# EasyEDA Pro project MicroMouse_v03_full_plane.eprj, schematic Schematic1

## Sheets
1 Overview: Board Name: Board1; Create Date: 2025-10-08; Page Name: Overview; Project Name: MicroMouse_v03; Schematic Name: Schematic1; Update Date: 2025-10-08; Company: FH-Hagenberg; Drawn: Viktor Hofer; Page Size: A3; Version: V0.1
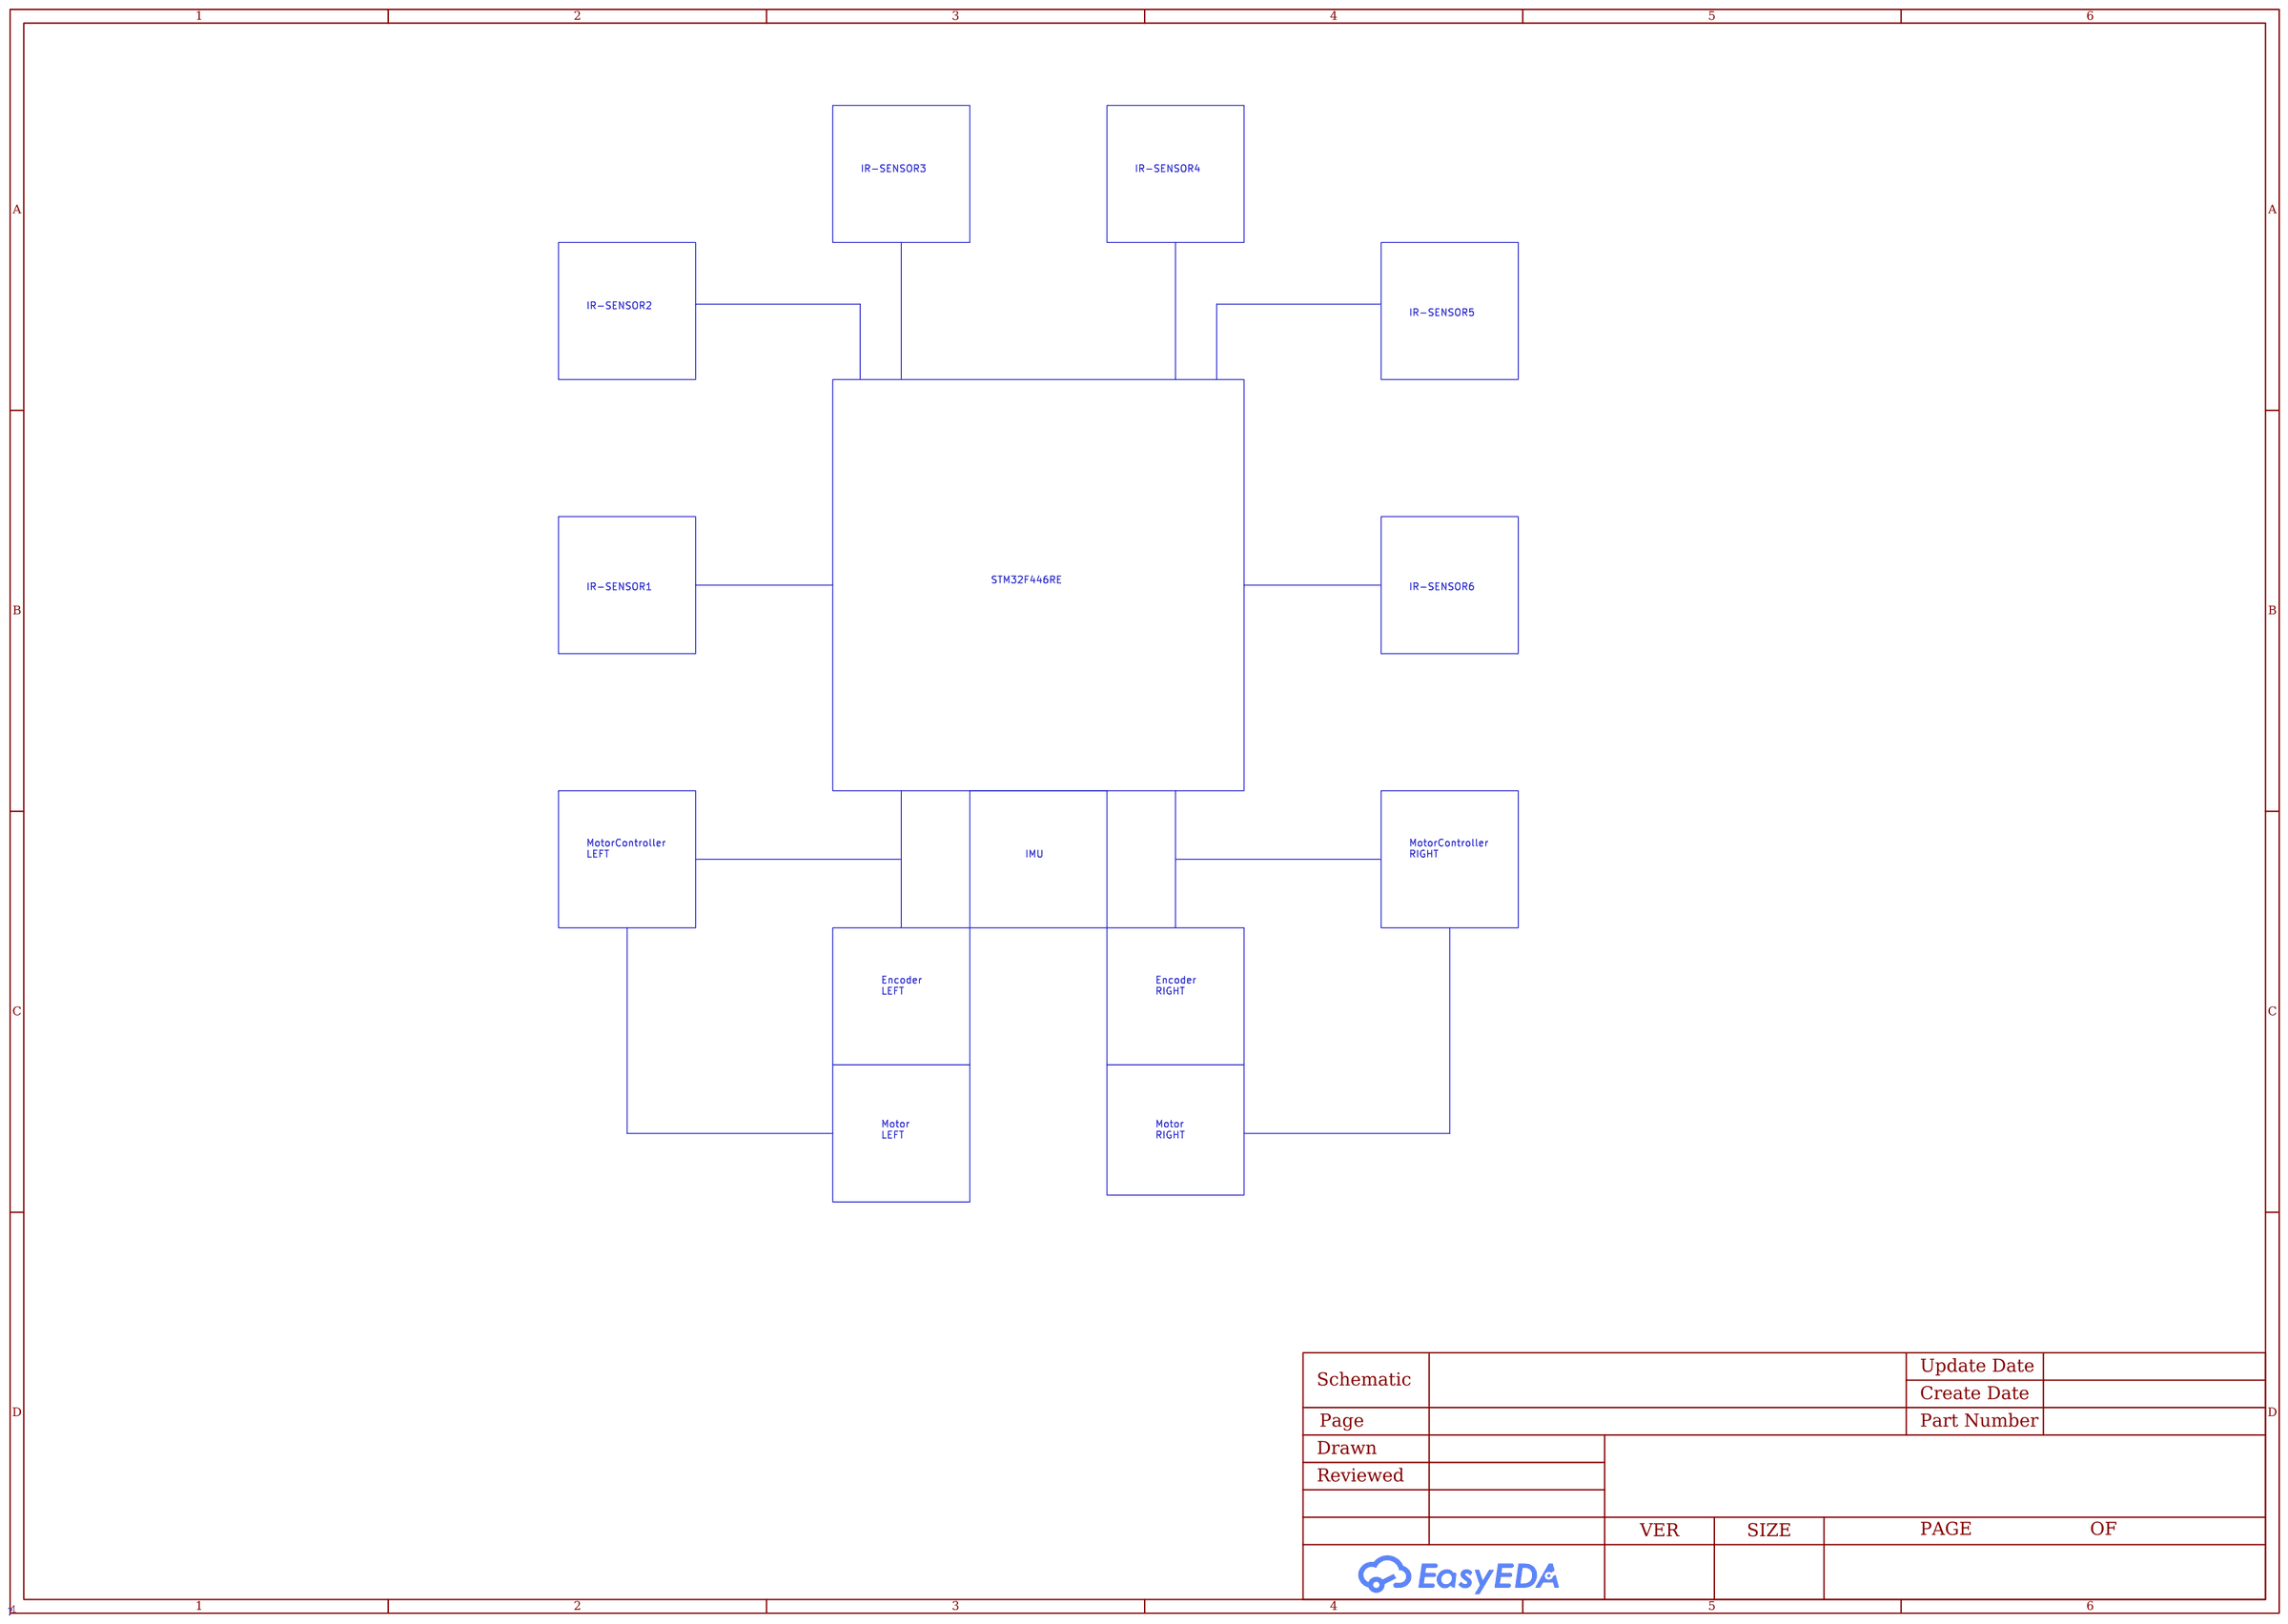
[diagram p0: Overview]
2 VCC: Create Date: 2025-12-17; Page Name: VCC; Project Name: MicroMouse_v03_full_plane; Update Date: 2025-12-17
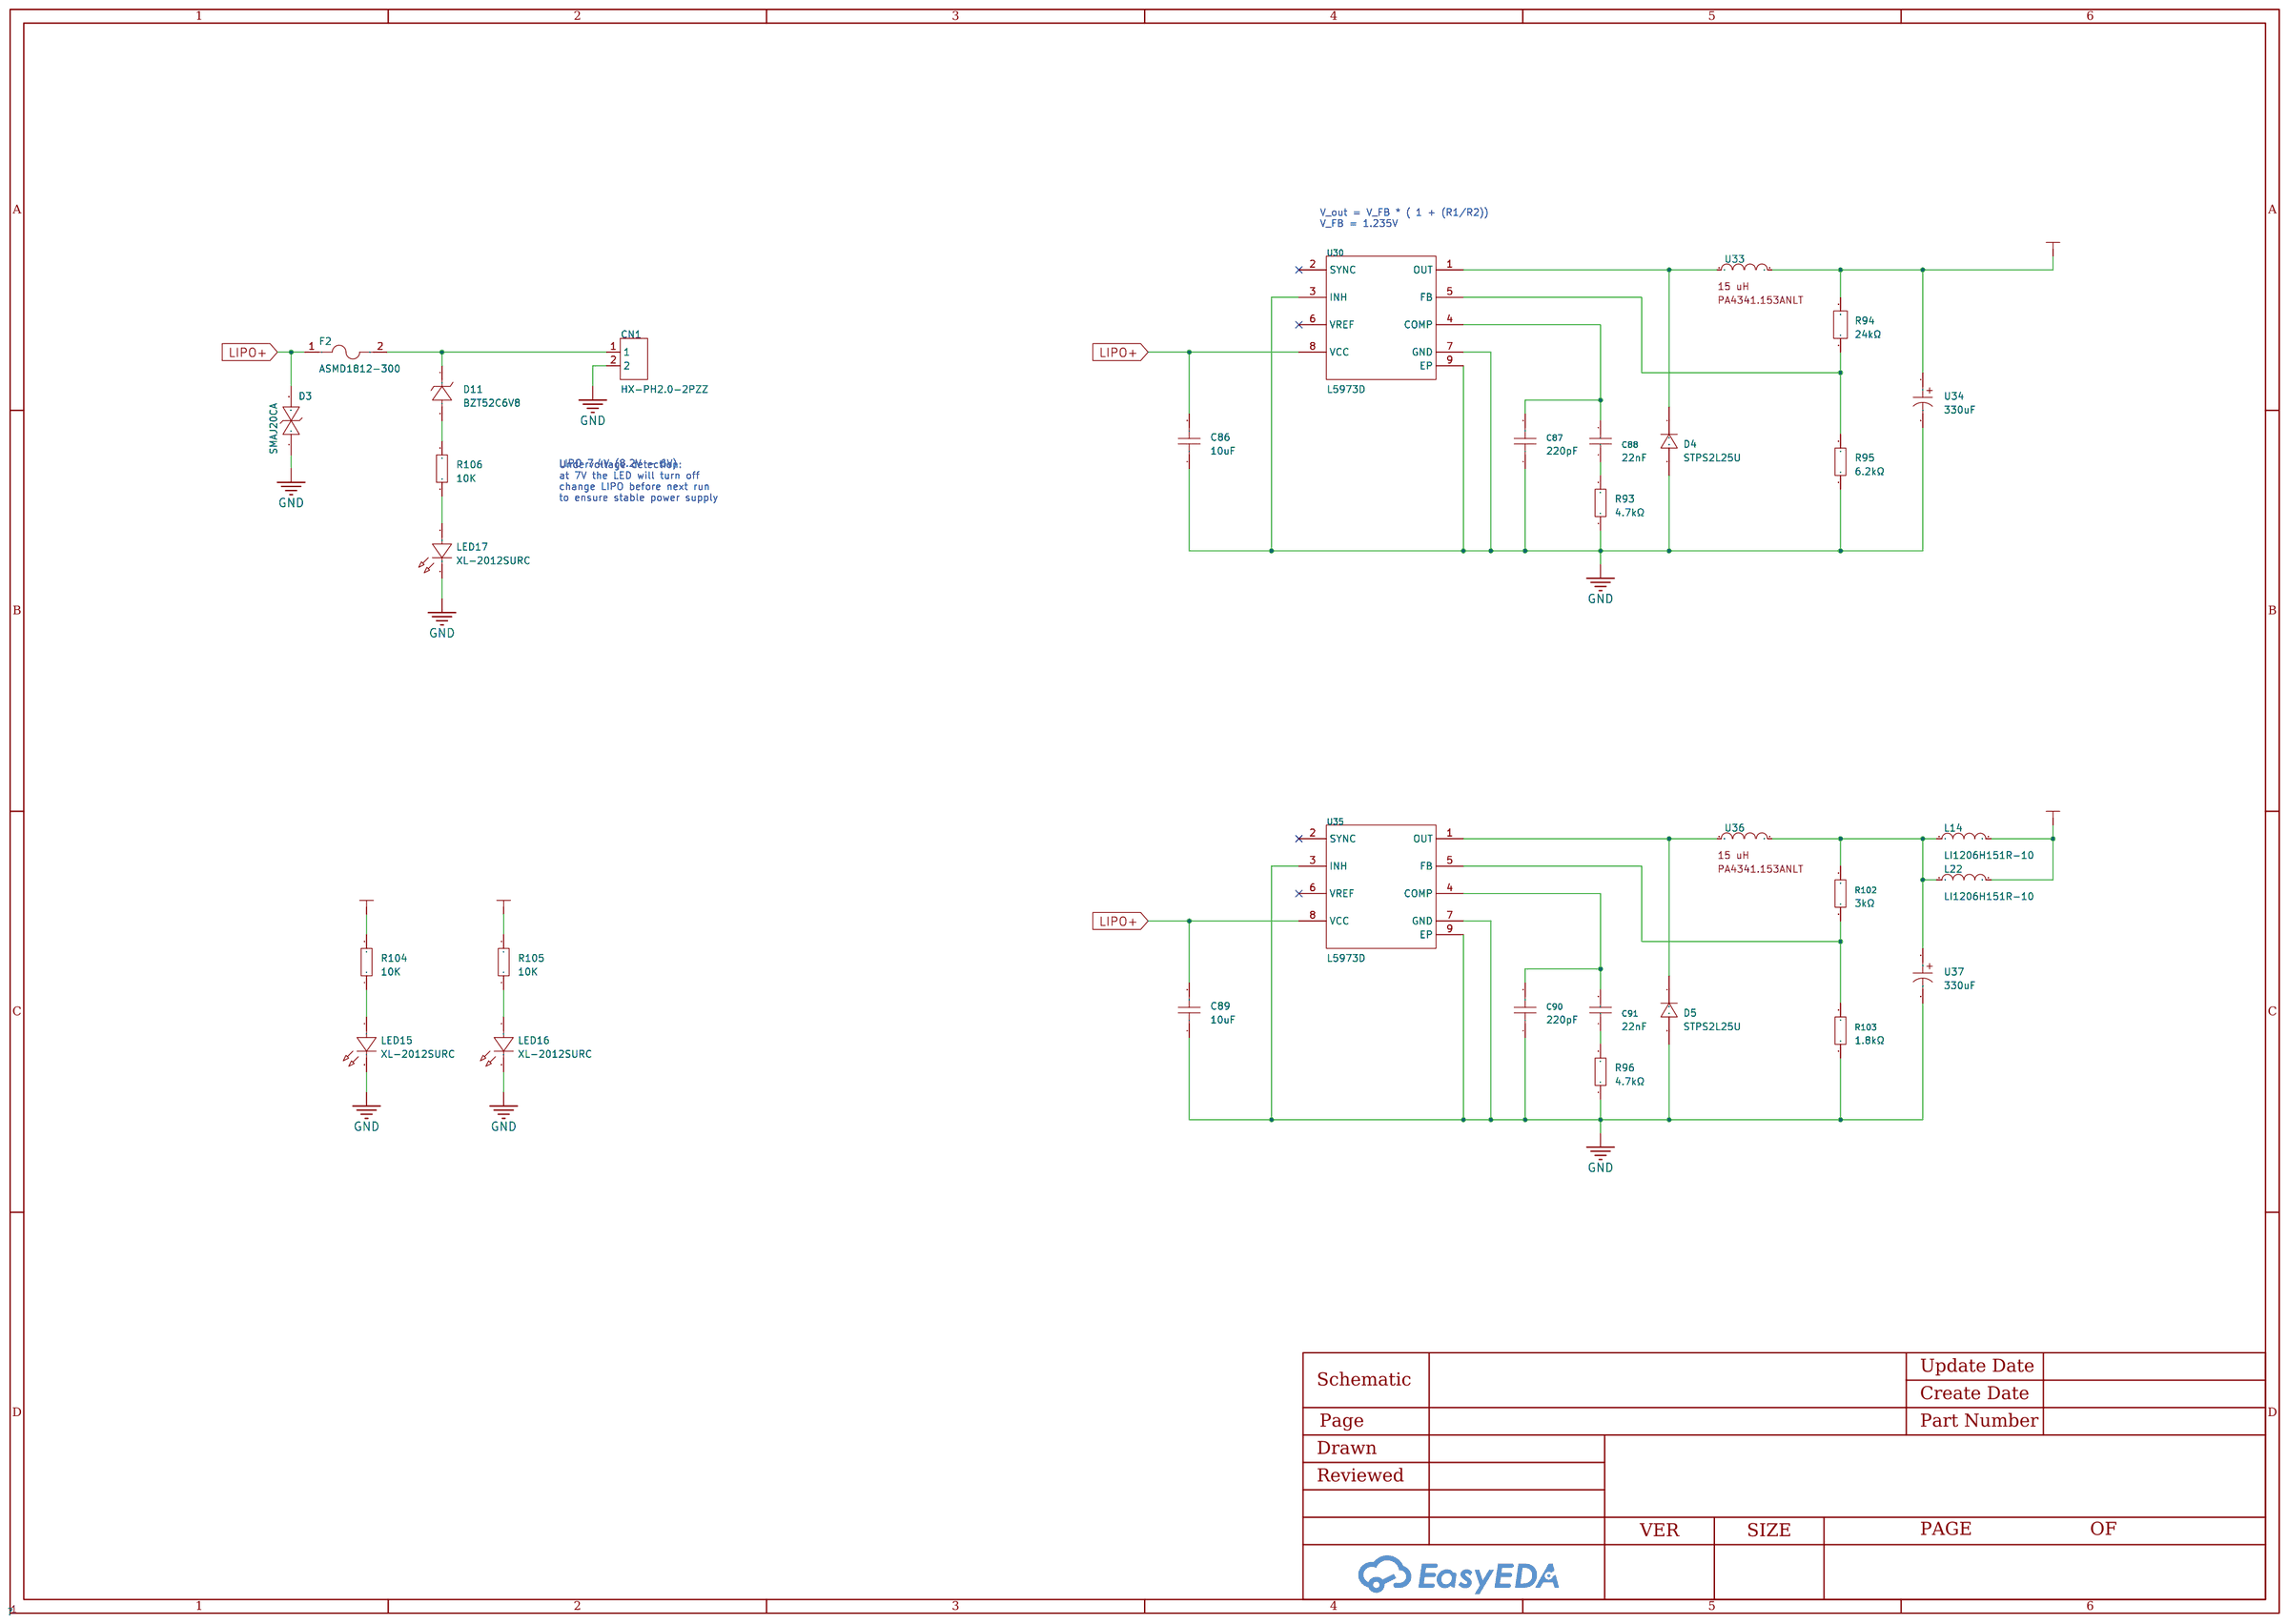
[diagram p1: VCC]
3 Controller: Page Name: Controller; Update Date: 2025-12-03
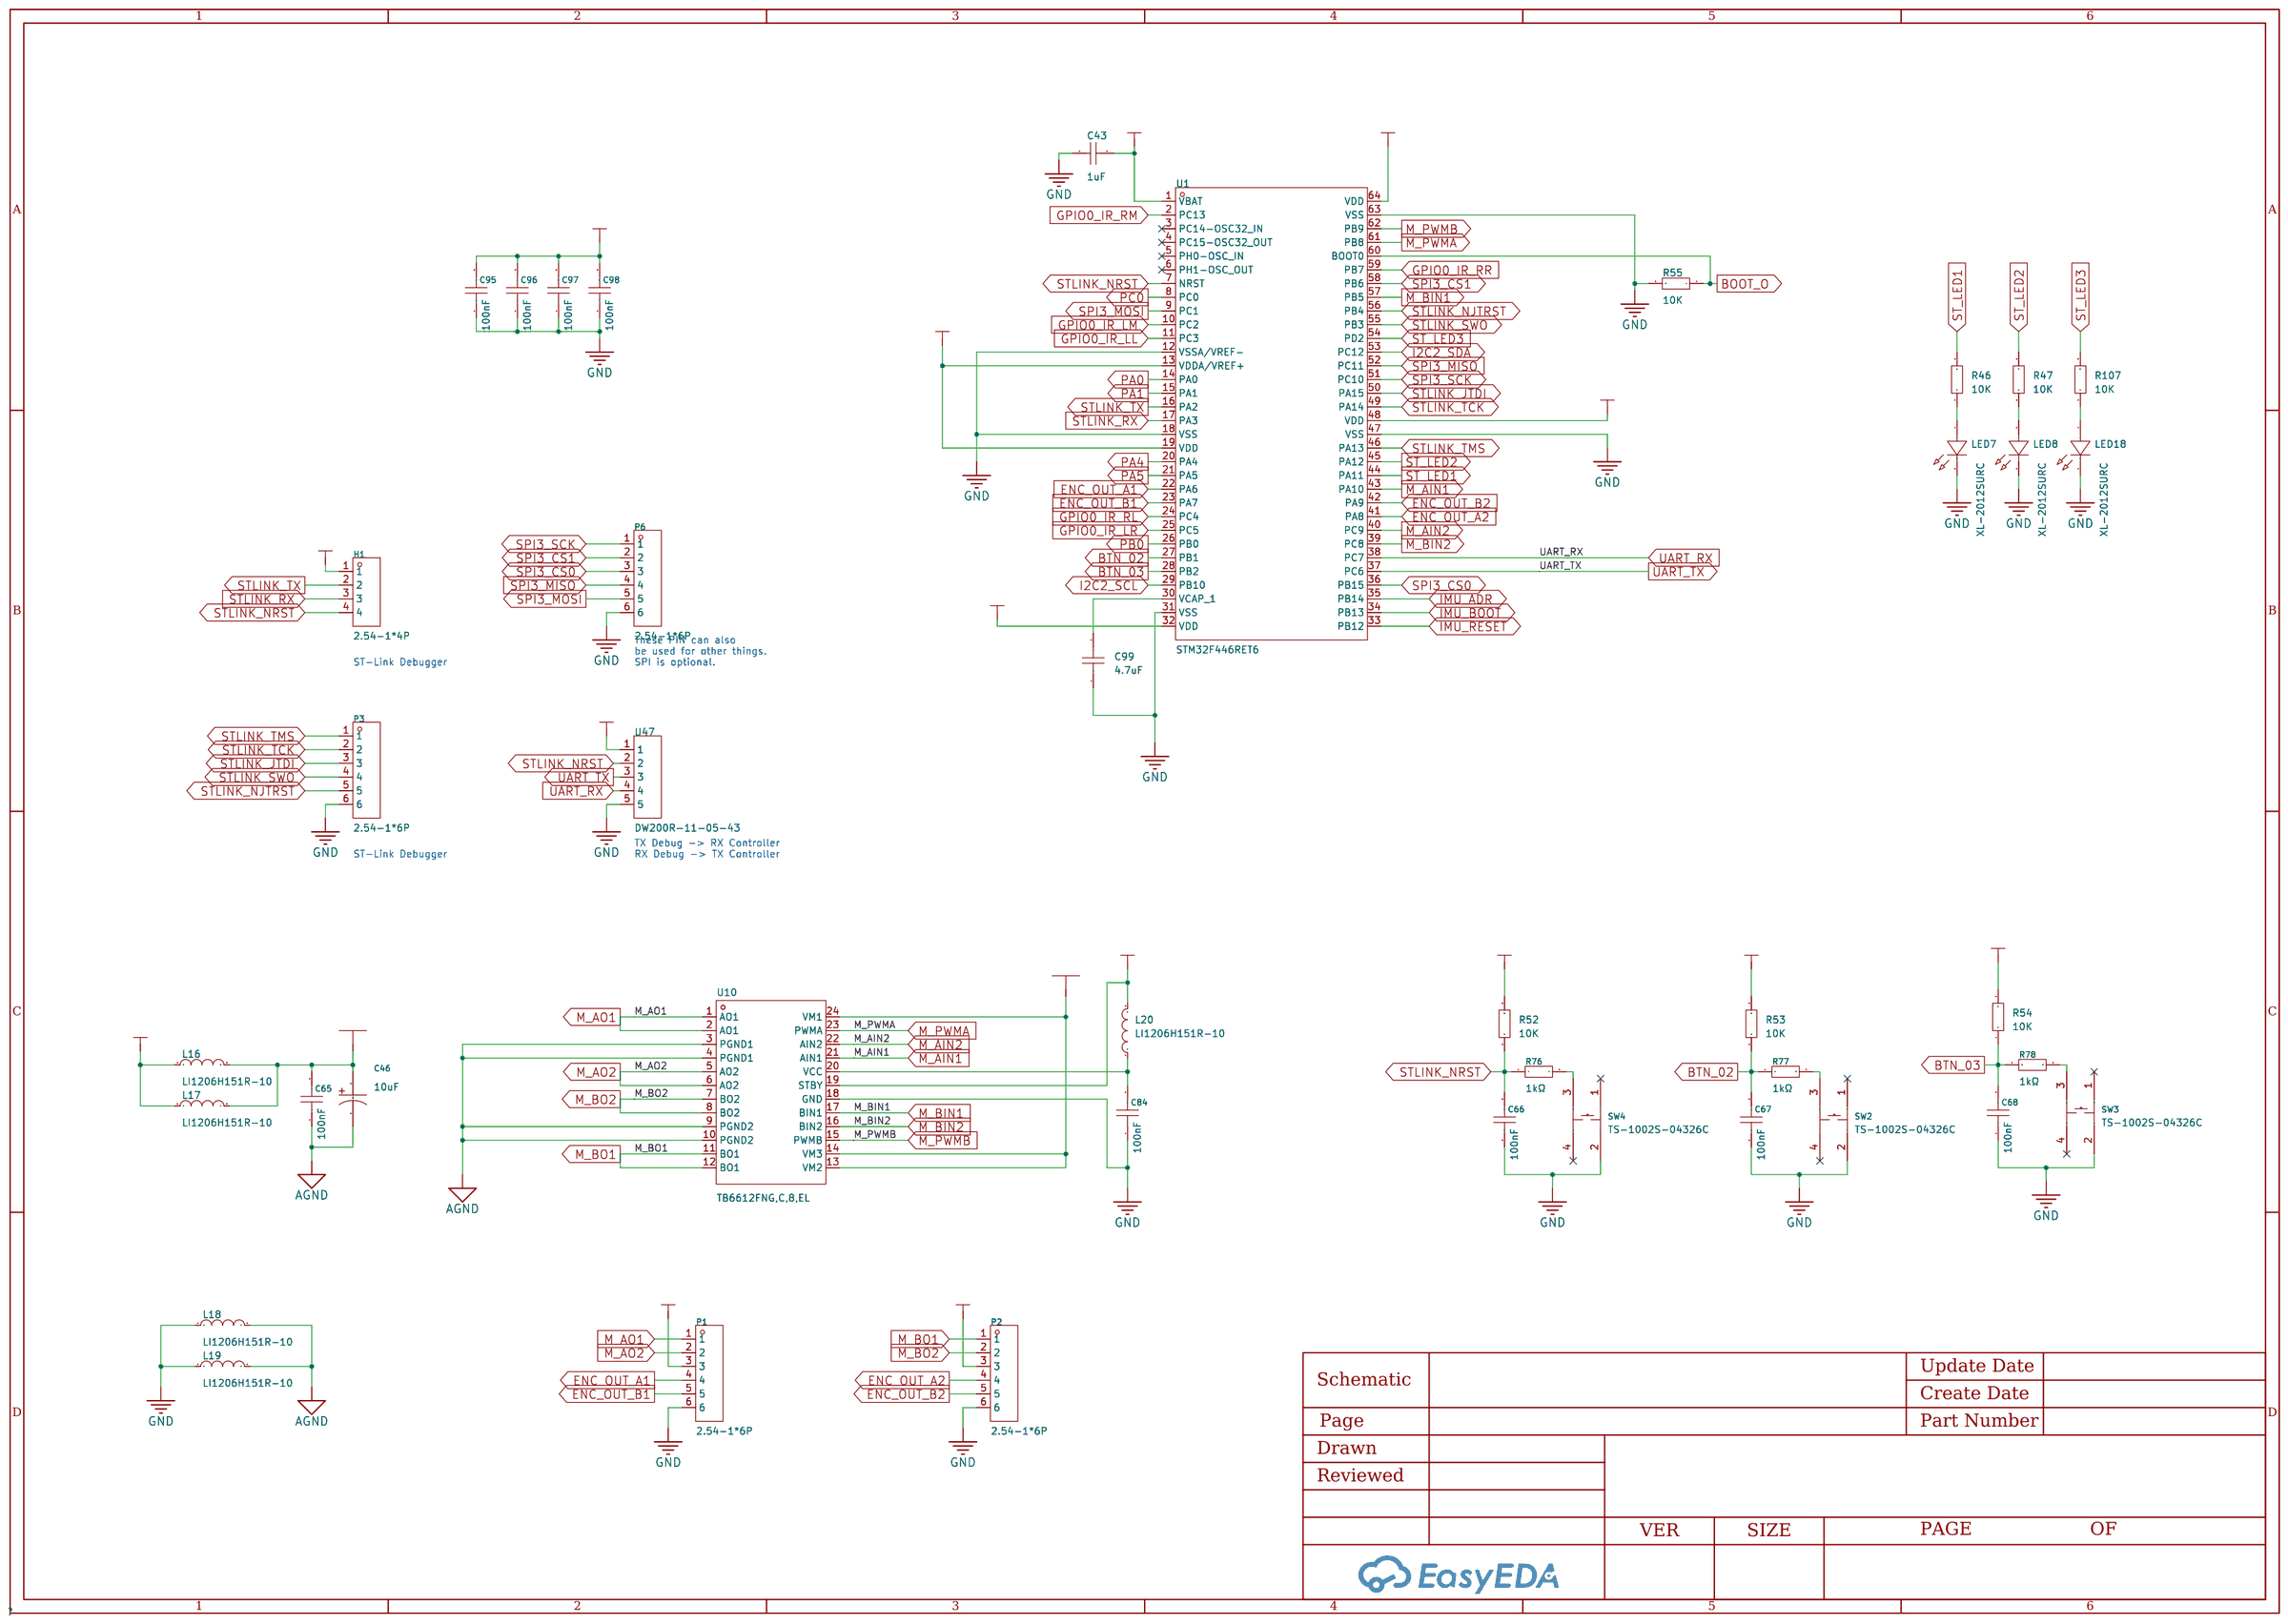
[diagram p2: Controller]
4 Sensors: Page Name: Sensors; Update Date: 2025-12-03
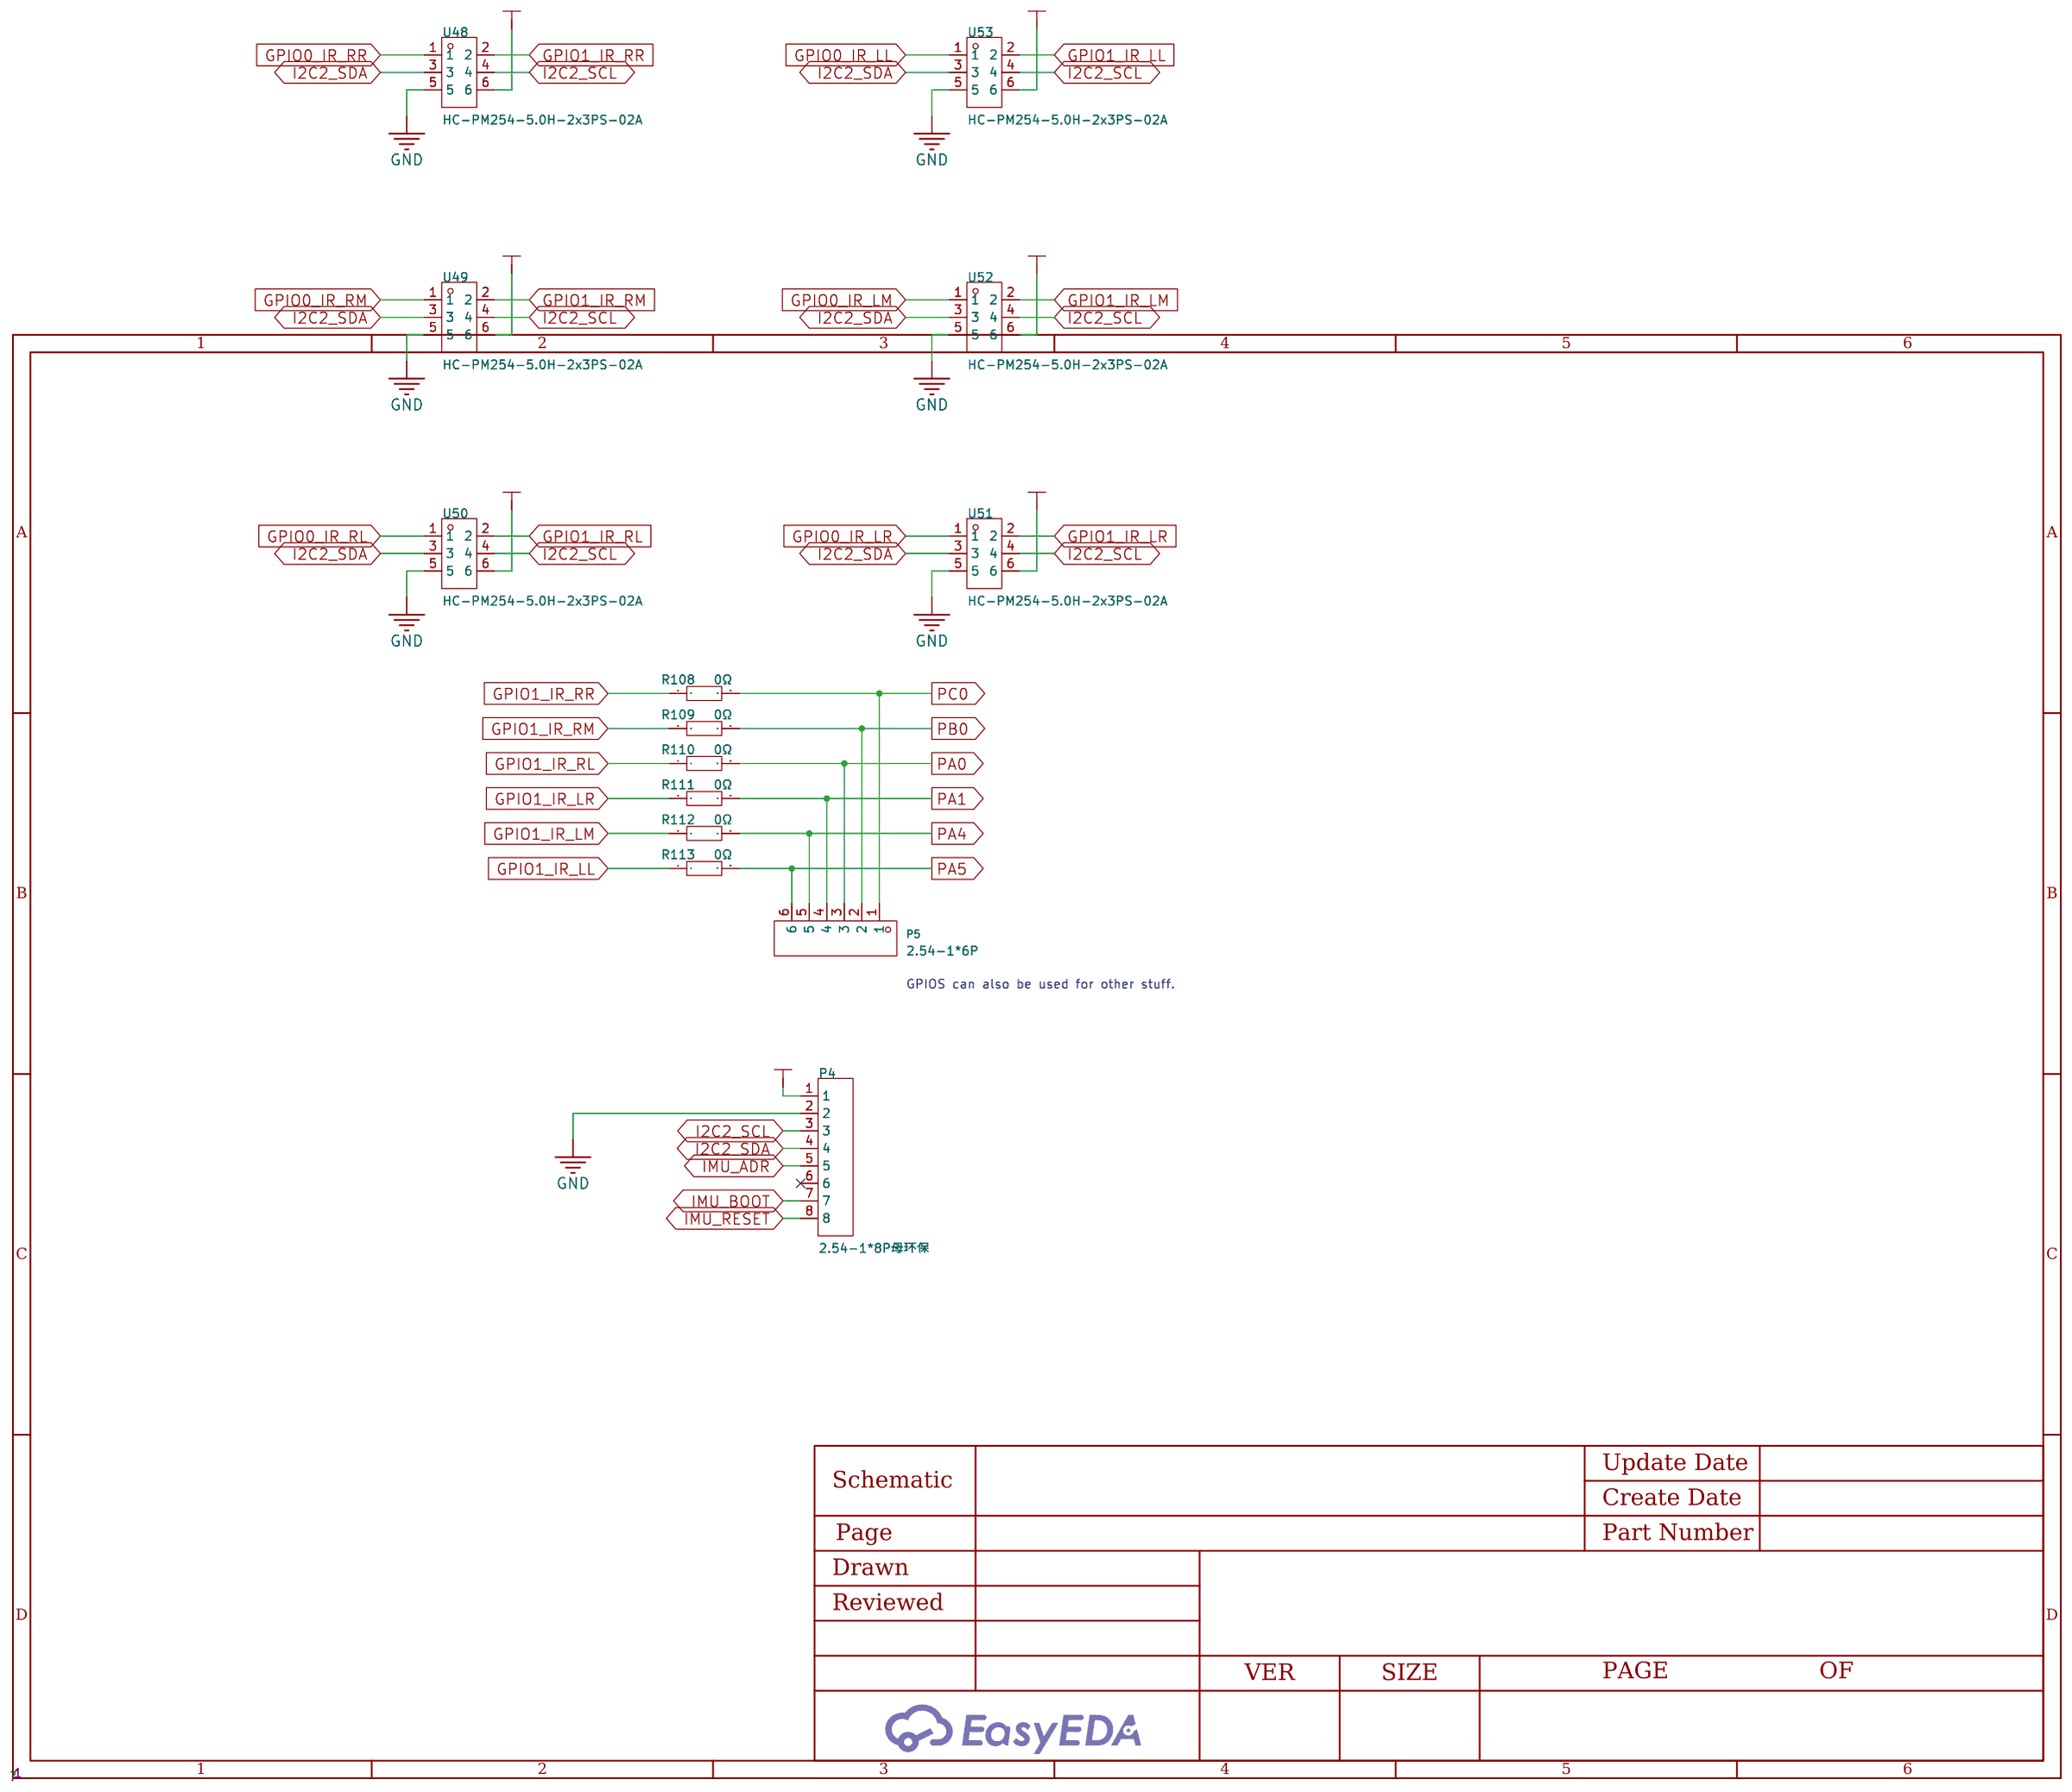
[diagram p3: Sensors]

## Parts
sheet Controller
C43  1uF  [C0603]
C46  10uF  [CAP-TH_BD5.0-P5.00-D1.0-FD]
C65  100nF  [C0603]
C66  100nF  [C0603]
C67  100nF  [C0603]
C68  100nF  [C0603]
C84  100nF  [C0603]
C95  100nF  [C0603]
C96  100nF  [C0603]
C97  100nF  [C0603]
C98  100nF  [C0603]
C99  4.7uF  [C0603]
H1  2.54-1*4P  [HDR-TH_4P-P2.54-V-F]
L16  LI1206H151R-10  [L1206]
L17  LI1206H151R-10  [L1206]
L18  LI1206H151R-10  [L1206]
L19  LI1206H151R-10  [L1206]
L20  LI1206H151R-10  [L1206]
LED7  XL-2012SURC  [LED0805-R-RD]
LED8  XL-2012SURC  [LED0805-R-RD]
LED18  XL-2012SURC  [LED0805-R-RD]
P1  2.54-1*6P  [HDR-TH_6P-P2.54-V-F]
P2  2.54-1*6P  [HDR-TH_6P-P2.54-V-F]
P3  2.54-1*6P  [HDR-TH_6P-P2.54-V-F]
P6  2.54-1*6P  [HDR-TH_6P-P2.54-V-F]
R46  10K  [R0603]
R47  10K  [R0603]
R52  10K  [R0603]
R53  10K  [R0603]
R54  10K  [R0603]
R55  10K  [R0603]
R76  1kΩ  [R0603]
R77  1kΩ  [R0603]
R78  1kΩ  [R0603]
R107  10K  [R0603]
SW2  TS-1002S-04326C  [KEY-SMD_4P-L6.0-W6.0-P4.50-LS9.0]
SW3  TS-1002S-04326C  [KEY-SMD_4P-L6.0-W6.0-P4.50-LS9.0]
SW4  TS-1002S-04326C  [KEY-SMD_4P-L6.0-W6.0-P4.50-LS9.0]
U1  STM32F446RET6  [LQFP-64_L10.0-W10.0-P0.50-LS12.0-BL]
U10  TB6612FNG,C,8,EL  [SSOP-24_L8.3-W5.6-P0.65-LS7.6-BL]
U47  DW200R-11-05-43  [HDR-TH_5P-P2.00-V-F]
sheet Sensors
P4  2.54-1*8P母环保  [HDR-TH_8P-P2.54-V-F_2]
P5  2.54-1*6P  [HDR-TH_6P-P2.54-V-F]
R108  0Ω  [R0603]
R109  0Ω  [R0603]
R110  0Ω  [R0603]
R111  0Ω  [R0603]
R112  0Ω  [R0603]
R113  0Ω  [R0603]
U48  HC-PM254-5.0H-2x3PS-02A  [CONN-SMD_HC-PM254-5.0H-2X3PS-02A]
U49  HC-PM254-5.0H-2x3PS-02A  [CONN-SMD_HC-PM254-5.0H-2X3PS-02A]
U50  HC-PM254-5.0H-2x3PS-02A  [CONN-SMD_HC-PM254-5.0H-2X3PS-02A]
U51  HC-PM254-5.0H-2x3PS-02A  [CONN-SMD_HC-PM254-5.0H-2X3PS-02A]
U52  HC-PM254-5.0H-2x3PS-02A  [CONN-SMD_HC-PM254-5.0H-2X3PS-02A]
U53  HC-PM254-5.0H-2x3PS-02A  [CONN-SMD_HC-PM254-5.0H-2X3PS-02A]
sheet VCC
C86  10uF  [C0805]
C87  220pF  [C0805]
C88  22nF  [C0805]
C89  10uF  [C0805]
C90  220pF  [C0805]
C91  22nF  [C0805]
CN1  HX-PH2.0-2PZZ  [CONN-TH_2P-P2.50_HX-PH2.0-2PZZ]
D3  SMAJ20CA  [SMA_L4.3-W2.6-LS5.2-BI]
D4  STPS2L25U  [SMB_L4.6-W3.6-LS5.3-RD]
D5  STPS2L25U  [SMB_L4.6-W3.6-LS5.3-RD]
D11  BZT52C6V8  [SOD-123_L2.7-W1.7-LS3.8-RD]
F2  ASMD1812-300  [F1812]
L14  LI1206H151R-10  [L1206]
L22  LI1206H151R-10  [L1206]
LED15  XL-2012SURC  [LED0805-R-RD]
LED16  XL-2012SURC  [LED0805-R-RD]
LED17  XL-2012SURC  [LED0805-R-RD]
R93  4.7kΩ  [R0603]
R94  24kΩ  [R0603]
R95  6.2kΩ  [R0603]
R96  4.7kΩ  [R0603]
R102  3kΩ  [R0603]
R103  1.8kΩ  [R0603]
R104  10K  [R0603]
R105  10K  [R0603]
R106  10K  [R0603]
U30  L5973D  [SOIC-8_L4.9-W3.9-P1.27-LS6.0-BL-EP]
U33  1.5uH  [IND-SMD_L7.6-W6.9]
U34  330uF  [CAP-SMD_BD6.3-L6.6-W6.6-LS7.4-FD]
U35  L5973D  [SOIC-8_L4.9-W3.9-P1.27-LS6.0-BL-EP]
U36  1.5uH  [IND-SMD_L7.6-W6.9]
U37  330uF  [CAP-SMD_BD6.3-L6.6-W6.6-LS7.4-FD]

## Library data of the parts
C43 = CL10A105KO8NNNC: Capacitance: Tolerance:±10% Tolerance:±10% Voltage Rated: Temperature Coefficient:; LCSC Part Name: 1uF ±10% 16V; Supplier Part: C1592; Manufacturer: SAMSUNG(三星); Supplier Footprint: 0603; JLCPCB Part Class: Extended Part; Datasheet: https://atta.szlcsc.com/upload/public/pdf/source/20220919/9FBE606BE0D9532D730F292EB26DC5BB.pdf; Supplier: LCSC; Tolerance: ±10%
C46 = UVZ1C100MDD1TA: Capacitance: Tolerance:±20% Tolerance:±20% Rated Voltage: Ripple Current:35mA@120Hz Equivalent Series Resistance(ESR):- Lead Spacing:2mm φD: L: Lifetime @ Temp:1000hrs@105℃ Operating Temperature:-55℃~+105℃ Operating Temperature:-55℃~+105℃; LCSC Part Name: 10uF ±20% 16V; Supplier Part: C250876; Manufacturer: Nichicon(尼吉康); Supplier Footprint: 插件,D5xL11mm; JLCPCB Part Class: Extended Part; Datasheet: https://atta.szlcsc.com/upload/public/pdf/source/20180925/C308870_1835EFB626D2D8CF3B207CFFD6F8F272.pdf; Supplier: LCSC; Tolerance: ±20%; Ripple Current: 35mA@120Hz; Lead Spacing: 2mm; Lifetime @ Temp: 1000hrs@105℃; Operating Temperature: -55℃~+105℃
C65-C68 C84 C95-C98 = CC0603KRX7R6BB104: Capacitance: Tolerance:±10% Tolerance:±10% Voltage Rated: Temperature Coefficient:; LCSC Part Name: 100nF ±10% 10V; Supplier Part: C519438; Manufacturer: YAGEO(国巨); Supplier Footprint: 0603; JLCPCB Part Class: Extended Part; Datasheet: https://atta.szlcsc.com/upload/public/pdf/source/20200423/C519438_5D8E3909BA347820A92655F61B0D4FC7.pdf; Supplier: LCSC; Tolerance: ±10%
C99 = CGA0603X5R475K250JT: Capacitance:4.7uF Tolerance:±10% Tolerance:±10% Voltage Rating:25V Temperature Coefficient:X5R; LCSC Part Name: 4.7uF ±10% 25V; Supplier Part: C6119856; Manufacturer: HRE(芯声); Supplier Footprint: 0603; JLCPCB Part Class: Extended Part; Supplier: LCSC; Tolerance: ±10%; Voltage Rating: 25V; Temperature Coefficient: X5R
H1 = 2.54-1*4P母: Holes Structure:1x4P Pitch:2.54mm Row Spacing:- Circular Hole / Square Hole:Square Holes Mounting Type:Straight Number of Rows:Plugin Number of Holes:4P Current Rating (Max):3A Voltage Rating (Max):- Holes Direction:Top Insulation Height:- Contact Materia; LCSC Part Name: 间距:2.54mm 1x4P 直插; Supplier Part: C2718488; Manufacturer: BOOMELE(博穆精密); Supplier Footprint: 插件,P=2.54mm; JLCPCB Part Class: Extended Part; Datasheet: https://atta.szlcsc.com/upload/public/pdf/source/20210301/C2718488_F4427B881E42CAA8DDB0B1C12B3A522C.pdf; Supplier: LCSC; Holes Structure: 1x4P; Pitch: 2.54mm; Circular Hole / Square Hole: Square Holes; Mounting Type: Straight; Number of Rows: Plugin; Number of Holes: 4P; Current Rating (Max): 3A; Holes Direction: Top; Contact Material: bronze; Operating Temperature Range: -40℃~+105℃
L14 L16-L20 L22 = LI1206H151R-10: Impedance @ Frequency:150Ω@100MHz DC Resistance(DCR):150mΩ Number of Circuits:1; LCSC Part Name: 150 Ω @ 100MHz 800mA; Supplier Part: C2442091; Manufacturer: Laird(莱尔德); Supplier Footprint: 1206; JLCPCB Part Class: Extended Part; Datasheet: https://item.szlcsc.com/datasheet/LI1206H151R-10/2533942.html; Supplier: LCSC; Impedance @ Frequency: 150Ω@100MHz; DC Resistance(DCR): 150mΩ; Number of Circuits: 1
LED7 LED8 LED15-LED18 = XL-2012SURC: Emitted Color:Red Power Dissipation:55mW Forward Current:25mA Dominant Wavelength:617nm~621nm Dominant Wavelength:617nm~621nm Peak Wavelength:623nm Lens Color:无色透明透镜 Color Temperature:- Color Temperature:- Viewing Angle:120° Mounting Sytle:Positive post O; Supplier Part: C965812; Manufacturer: XINGLIGHT(成兴光); Supplier Footprint: 0805; JLCPCB Part Class: Extended Part; Datasheet: https://atta.szlcsc.com/upload/public/pdf/source/20221102/49E1A0A365644091E6270AF1C5E0FE37.pdf; Supplier: LCSC; Emitted Color: Red; Power Dissipation: 55mW; Forward Current: 25mA; Dominant Wavelength: 617nm~621nm; Peak Wavelength: 623nm; Lens Color: 无色透明透镜; Viewing Angle: 120°; Mounting Sytle: Positive post; Operating Temperature: -30℃~+85℃
P1-P3 P5 P6 = 2.54-1*6P母: Holes Structure:1x6P Pitch:2.54mm Row Spacing:- Mounting Type:Straight Number of Rows:Plugin Number of Holes:6P Insulation Height:- Contact Material:- Contact Plating:-; LCSC Part Name: 间距:2.54mm 1x6P 直插; Supplier Part: C40877; Manufacturer: BOOMELE(博穆精密); Supplier Footprint: 插件,P=2.54mm; JLCPCB Part Class: Extended Part; Datasheet: https://atta.szlcsc.com/upload/public/pdf/source/20210301/C2718488_F4427B881E42CAA8DDB0B1C12B3A522C.pdf; Supplier: LCSC; Holes Structure: 1x6P; Pitch: 2.54mm; Mounting Type: Straight; Number of Rows: Plugin; Number of Holes: 6P
R46 R47 R52-R55 R104-R107 = Res_0603: DNI; Supplier Footprint: 0603
R76-R78 = 0603WAF1001T5E: Type:Thick Film Resistors Resistance:1kΩ Tolerance:±1% Tolerance:±1% Power(Watts): Overload Voltage (Max): Temperature Coefficient:±100ppm/℃ Temperature Coefficient:±100ppm/℃ Operating Temperature Range:-55℃~+155℃ Operating Temperature Range:-55℃~+155℃; LCSC Part Name: 1kΩ ±1% 100mW 厚膜电阻; Supplier Part: C21190; Manufacturer: UNI-ROYAL(厚声); Supplier Footprint: 0603; JLCPCB Part Class: Basic Part; Datasheet: https://atta.szlcsc.com/upload/public/pdf/source/20200306/C422600_1E6D84923E4A46A82E41ADD87F860B5C.pdf; Supplier: LCSC; Type: Thick Film Resistors; Tolerance: ±1%; Temperature Coefficient: ±100ppm/℃; Operating Temperature Range: -55℃~+155℃
SW2-SW4 = TS-1002S-04326C: Circuit:SPST Actuator Style:Round Button Mounting Style:Brick nogging Switch Length:6mm Switch Width:6mm Switch Height:4.3mm Contact Current:50mA Voltage Rating (DC):12V With Lamp:- Mechanical Life:-; LCSC Part Name: 6*6*4.3mm 立贴 轻触开关; Supplier Part: C455108; Manufacturer: XUNPU(讯普); Supplier Footprint: SMD,6x6mm; JLCPCB Part Class: Extended Part; Datasheet: https://atta.szlcsc.com/upload/public/pdf/source/20191118/C455126_F61E8FA1ED640FB1CE0B30B55DEB62E3.pdf; Supplier: LCSC; Circuit: SPST; Actuator Style: Round Button; Mounting Style: Brick nogging; Switch Length: 6mm; Switch Width: 6mm; Switch Height: 4.3mm; Contact Current: 50mA; Voltage Rating (DC): 12V
U1 = STM32F446RET6: CPU Core:CM4 Program Storage Size:512KB RAM Size:128KB GPIO Ports Number:50 Operating Voltage Range:1.7V~3.6V Operating Voltage Range:1.7V~3.6V CPU Maximum Speed:180MHz Program Memory Type:FLASH Operating Temperature Range:-40℃~+85℃ Operating Temperature; LCSC Part Name: STM32F446RET6 MSL=3; Supplier Part: C69336; Manufacturer: ST(意法半导体); Supplier Footprint: LQFP-64(10x10); JLCPCB Part Class: Extended Part; Datasheet: https://atta.szlcsc.com/upload/public/pdf/source/20170518/1495086068896.pdf; Supplier: LCSC; CPU Core: CM4; Program Storage Size: 512KB; RAM Size: 128KB; GPIO Ports Number: 50; Operating Voltage Range: 1.7V~3.6V; CPU Maximum Speed: 180MHz; Program Memory Type: FLASH; Operating Temperature Range: -40℃~+85℃; ADC (Bit): 12bit; DAC (Bit): 12bit; Universal Serial Bus: 有; Peripheral/Function: PWM；PWM；Low-Voltage检测; Watchdog: 有; Infrared Data Association: 有; Low-Voltage Detect: 有; Direct Memory Access: 有; Internal Oscillator: 有
U10 = TB6612FNG,C,8,EL: LCSC Part Name: 1A 有刷直流电机驱动芯片 5.5V; Supplier Part: C141517; Manufacturer: TOSHIBA(东芝); Supplier Footprint: SSOP-24; JLCPCB Part Class: Extended Part; Datasheet: https://atta.szlcsc.com/upload/public/pdf/source/20171128/C141517_15118625624231147036.pdf; Supplier: LCSC
U47 = DW200R-11-05-43: Holes Structure:1x5P Pitch:2mm Row Spacing:- Circular Hole / Square Hole:Square Hole Mounting Type:Through Hole Number of Rows:1 Number of Positions:5P Current Rating:1.5A Voltage Rating (Max):- Holes Direction:Top Insulation Height:4.3mm Operating Temper; LCSC Part Name: 1x5P 间距:2mm 直插; Supplier Part: C2935969; Manufacturer: DEALON(德艺隆); Supplier Footprint: 插件,P=2mm; JLCPCB Part Class: Extended Part; Datasheet: https://item.szlcsc.com/datasheet/DW200R-11-05-43/3287547.html; Supplier: LCSC; Holes Structure: 1x5P; Pitch: 2mm; Circular Hole / Square Hole: Square Hole; Mounting Type: Through Hole; Number of Rows: 1; Number of Positions: 5P; Current Rating: 1.5A; Holes Direction: Top; Insulation Height: 4.3mm
P4 = 2.54-1*8P母环保: Holes Structure:1x8P Pitch:2.54mm Row Spacing:- Circular Hole / Square Hole:Square Hole Mounting Type:Through Hole Number of Rows:1 Number of Positions:8P Holes Direction:Top Insulation Height:- Contact Material:- Contact Plating:-; LCSC Part Name: 1x8P 间距:2.54mm 直插; Supplier Part: C27438; Manufacturer: BOOMELE(博穆精密); Supplier Footprint: 插件,P=2.54mm; JLCPCB Part Class: Extended Part; Datasheet: https://item.szlcsc.com/datasheet/2.54-1*8P%25E6%25AF%258D%25E7%258E%25AF%25E4%25BF%259D/28187.html; Supplier: LCSC; Holes Structure: 1x8P; Pitch: 2.54mm; Circular Hole / Square Hole: Square Hole; Mounting Type: Through Hole; Number of Rows: 1; Number of Positions: 8P; Holes Direction: Top
R108-R113 = 0603WAF0000T5E: Type:Thick Film Resistors Resistance: Tolerance:±1% Tolerance:±1% Power(Watts): Overload Voltage (Max): Operating Temperature Range:-55℃~+155℃ Operating Temperature Range:-55℃~+155℃; LCSC Part Name: 0Ω ±1% 100mW 厚膜电阻; Supplier Part: C21189; Manufacturer: UNI-ROYAL(厚声); Supplier Footprint: 0603; JLCPCB Part Class: Basic Part; Datasheet: https://atta.szlcsc.com/upload/public/pdf/source/20200306/C422600_1E6D84923E4A46A82E41ADD87F860B5C.pdf; Supplier: LCSC; Type: Thick Film Resistors; Tolerance: ±1%; Operating Temperature Range: -55℃~+155℃
U48-U53 = HC-PM254-5.0H-2x3PS-02A: Holes Structure:2x3P Pitch:2.54mm Row Spacing:2.54mm Circular Hole / Square Hole:Square Hole Mounting Type:Surface Mount,Vertical Number of Rows:2 Number of Positions:6P Current Rating:3A Voltage Rating (Max):- Holes Direction:Top Insulation Height:5mm Co; LCSC Part Name: 间距2.54mm 2x3Pin 立贴 PW7.4 H5.0; Supplier Part: C42163131; Manufacturer: HC(虹成电子); Supplier Footprint: SMD,P=2.54mm; JLCPCB Part Class: Extended Part; Datasheet: https://item.szlcsc.com/datasheet/HC-PM254-5.0H-2x3PS-02A/44033120.html; Supplier: LCSC; Holes Structure: 2x3P; Pitch: 2.54mm; Row Spacing: 2.54mm; Circular Hole / Square Hole: Square Hole; Mounting Type: Surface Mount,Vertical; Number of Rows: 2; Number of Positions: 6P; Current Rating: 3A; Holes Direction: Top; Insulation Height: 5mm; Contact Material: Brass; Contact Plating: Gold; Operating Temperature: -40℃~+105℃
C86 C89 = CL21A106KAYNNNE_C15850: Capacitance:10uF Tolerance:±10% Tolerance:±10% Voltage Rating:25V Temperature Coefficient:X5R; LCSC Part Name: 10uF ±10% 25V; Supplier Part: C15850; Manufacturer: SAMSUNG(三星); Manufacturer Part: CL21A106KAYNNNE; Supplier Footprint: 0805; JLCPCB Part Class: Basic Part; Datasheet: https://item.szlcsc.com/datasheet/CL21A106KAYNNNE/16532.html; Supplier: LCSC; Tolerance: ±10%; Voltage Rating: 25V; Temperature Coefficient: X5R
C87 C90 = CC0805KRX7R8BB223: Capacitance:22nF Tolerance:±10% Tolerance:±10% Voltage Rating:25V Temperature Coefficient:X7R; LCSC Part Name: 22nF ±10% 25V; Supplier Part: C327278; Manufacturer: YAGEO(国巨); Supplier Footprint: 0805; JLCPCB Part Class: Extended Part; Datasheet: https://item.szlcsc.com/datasheet/CC0805KRX7R8BB223/307372.html; Supplier: LCSC; Tolerance: ±10%; Voltage Rating: 25V; Temperature Coefficient: X7R
C88 C91 = CC0805KRX7R9BB221: Capacitance:220pF Tolerance:±10% Tolerance:±10% Voltage Rating:50V Temperature Coefficient:X7R; LCSC Part Name: 220pF ±10% 50V; Supplier Part: C107145; Manufacturer: YAGEO(国巨); Supplier Footprint: 0805; JLCPCB Part Class: Basic Part; Datasheet: https://item.szlcsc.com/datasheet/CC0805KRX7R9BB221/108361.html; Supplier: LCSC; Tolerance: ±10%; Voltage Rating: 50V; Temperature Coefficient: X7R
CN1 = HX-PH2.0-2PZZ: Pins Structure:1x2P Pitch:2mm Mounting Type:Through Hole Reference Series:PH Number of Pins:2P Number of Rows:1 Number of PINs Per Row:2 Row Spacing:- Current Rating:2A Contact Material:Brass Contact Plating:Tin Operating Temperature:-25℃~+85℃ Operating T; LCSC Part Name: 1x2P 间距:2mm 直插 系列:PH; Supplier Part: C48641617; Manufacturer: hanxia(韩下); Supplier Footprint: 插件,P=2mm; JLCPCB Part Class: Extended Part; Datasheet: https://item.szlcsc.com/datasheet/HX-PH2.0-2PZZ/50919863.html; Supplier: LCSC; Pins Structure: 1x2P; Pitch: 2mm; Mounting Type: Through Hole; Reference Series: PH; Number of Pins: 2P; Number of Rows: 1; Number of PINs Per Row: 2; Current Rating: 2A; Contact Material: Brass; Contact Plating: Tin; Operating Temperature: -25℃~+85℃; Voltage Rating: 250V; Plastic Material: PA66; Flame Retardant Rating: UL94V-0; Color: White
D3 = SMAJ20CA_C514090: Reverse Stand-Off Voltage (Vrwm):20V Maximum Clamping Voltage:32.4V Peak Pulse Current (Ipp)@10/1000us:12.3A Breakdown Voltage:22.2V Reverse Leakage Current (Ir):5uA Type:TVS; LCSC Part Name: 双向TVS 20V截止 12.3A峰值脉冲; Supplier Part: C514090; Manufacturer: High Diode(海德); Supplier Footprint: SMA; JLCPCB Part Class: Extended Part; Datasheet: https://atta.szlcsc.com/upload/public/pdf/source/20200416/C514088_CFF28F05FD8C483B94F6F04E6D3574FF.pdf; Supplier: LCSC; Reverse Stand-Off Voltage (Vrwm): 20V; Maximum Clamping Voltage: 32.4V; Peak Pulse Current (Ipp)@10/1000us: 12.3A; Breakdown Voltage: 22.2V; Reverse Leakage Current (Ir): 5uA; Type: TVS
D4 D5 = STPS2L25U: Forward Voltage (Vf@If):450mV@2A Reverse Voltage (Vr):25V Rectified Current:2A Reverse Leakage Current (Ir):90uA@25V; LCSC Part Name: 电压:25V 电流:2A; Supplier Part: C283261; Manufacturer: ST(意法半导体); Supplier Footprint: SMB; JLCPCB Part Class: Extended Part; Datasheet: https://atta.szlcsc.com/upload/public/pdf/source/20181026/C283261_D4A5E3A680EC68463538C2F955245C61.pdf; Supplier: LCSC; Forward Voltage (Vf@If): 450mV@2A; Reverse Voltage (Vr): 25V; Rectified Current: 2A; Reverse Leakage Current (Ir): 90uA@25V
D11 = BZT52C6V8_C726998: Diode Configuration:Independent Zener Voltage(Nom):6.8V Reverse Leakage Current (Ir):2uA@4V Zener Voltage(Range):6.4V~7.2V Zener Voltage(Range):6.4V~7.2V Pd - Power Dissipation:500mW Impedance(Zzt):15Ω Impedance(Zzk):80Ω Operating Junction Temperature Ran; LCSC Part Name: 独立式 耐压:6.8V 电流:2uA@4V; Supplier Part: C726998; Manufacturer: TWGMC(迪嘉); Supplier Footprint: SOD-123; JLCPCB Part Class: Extended Part; Datasheet: https://item.szlcsc.com/datasheet/BZT52C6V8/774103.html; Supplier: LCSC; Diode Configuration: Independent; Zener Voltage(Nom): 6.8V; Reverse Leakage Current (Ir): 2uA@4V; Zener Voltage(Range): 6.4V~7.2V; Pd - Power Dissipation: 500mW; Impedance(Zzt): 15Ω; Impedance(Zzk): 80Ω; Operating Junction Temperature Range: -55℃~+150℃
F2 = ASMD1812-300: Operating Voltage (Max):8V Current Rating (Max):100A Hold Current:3A Trip Current:5A Power Dissipation:800mW Resistance - Initial (Ri) (Min):12mΩ Resistance - Post Trip (R1) (Max):40mΩ Maximum Time to Trip:4s Operating Temperature:-40℃~+85℃ Operating Temp; LCSC Part Name: 8V 3A 1812自恢复; Supplier Part: C135366; Manufacturer: JDTfuse(集电通); Supplier Footprint: 1812; JLCPCB Part Class: Extended Part; Datasheet: https://atta.szlcsc.com/upload/public/pdf/source/20230515/141EC6E8F2A6D78FC40635A196E31E08.pdf; Supplier: LCSC; Operating Voltage (Max): 8V; Current Rating (Max): 100A; Hold Current: 3A; Trip Current: 5A; Power Dissipation: 800mW; Resistance - Initial (Ri) (Min): 12mΩ; Resistance - Post Trip (R1) (Max): 40mΩ; Maximum Time to Trip: 4s; Operating Temperature: -40℃~+85℃
R93 R96 = 0603WAF4701T5E: Type:Thick Film Resistor Resistance:4.7kΩ Tolerance:±1% Tolerance:±1% Power(Watts):100mW Voltage-Supply(Max):75V Temperature Coefficient:±100ppm/℃ Temperature Coefficient:±100ppm/℃ Operating Temperature:-55℃~+155℃ Operating Temperature:-55℃~+155℃; LCSC Part Name: 4.7kΩ ±1% 100mW 厚膜电阻; Supplier Part: C23162; Manufacturer: UNI-ROYAL(厚声); Supplier Footprint: 0603; JLCPCB Part Class: Basic Part; Datasheet: https://item.szlcsc.com/datasheet/0603WAF4701T5E/23889.html; Supplier: LCSC; Type: Thick Film Resistor; Tolerance: ±1%; Power(Watts): 100mW; Voltage-Supply(Max): 75V; Temperature Coefficient: ±100ppm/℃; Operating Temperature: -55℃~+155℃
R94 = FRC0603F2402TS: Type:Thick Film Resistor Resistance:24kΩ Tolerance:±1% Tolerance:±1% Power(Watts):100mW Voltage-Supply(Max):75V Temperature Coefficient:±100ppm/℃ Temperature Coefficient:±100ppm/℃ Operating Temperature:-55℃~+155℃ Operating Temperature:-55℃~+155℃; LCSC Part Name: 24kΩ ±1% 100mW 厚膜电阻; Supplier Part: C2930081; Manufacturer: FOJAN(富捷); Supplier Footprint: 0603; JLCPCB Part Class: Extended Part; Supplier: LCSC; Type: Thick Film Resistor; Tolerance: ±1%; Power(Watts): 100mW; Voltage-Supply(Max): 75V; Temperature Coefficient: ±100ppm/℃; Operating Temperature: -55℃~+155℃
R95 = 0603WAF6201T5E: Type:Thick Film Resistor Resistance:6.2kΩ Tolerance:±1% Tolerance:±1% Power(Watts):100mW Voltage-Supply(Max):75V Temperature Coefficient:±100ppm/℃ Temperature Coefficient:±100ppm/℃ Operating Temperature:-55℃~+155℃ Operating Temperature:-55℃~+155℃; LCSC Part Name: 6.2kΩ ±1% 100mW 厚膜电阻; Supplier Part: C4260; Manufacturer: UNI-ROYAL(厚声); Supplier Footprint: 0603; JLCPCB Part Class: Basic Part; Datasheet: https://item.szlcsc.com/datasheet/0603WAF6201T5E/4667.html; Supplier: LCSC; Type: Thick Film Resistor; Tolerance: ±1%; Power(Watts): 100mW; Voltage-Supply(Max): 75V; Temperature Coefficient: ±100ppm/℃; Operating Temperature: -55℃~+155℃
R102 = 0603WAF3001T5E: Type:Thick Film Resistor Resistance:3kΩ Tolerance:±1% Tolerance:±1% Power(Watts):100mW Voltage-Supply(Max):75V Temperature Coefficient:±100ppm/℃ Temperature Coefficient:±100ppm/℃ Operating Temperature:-55℃~+155℃ Operating Temperature:-55℃~+155℃; LCSC Part Name: 3kΩ ±1% 100mW 厚膜电阻; Supplier Part: C4211; Manufacturer: UNI-ROYAL(厚声); Supplier Footprint: 0603; JLCPCB Part Class: Basic Part; Datasheet: https://item.szlcsc.com/datasheet/0603WAF3001T5E/4618.html; Supplier: LCSC; Type: Thick Film Resistor; Tolerance: ±1%; Power(Watts): 100mW; Voltage-Supply(Max): 75V; Temperature Coefficient: ±100ppm/℃; Operating Temperature: -55℃~+155℃
R103 = 0603WAF1801T5E: Type:Thick Film Resistor Resistance:1.8kΩ Tolerance:±1% Tolerance:±1% Power(Watts):100mW Voltage-Supply(Max):75V Temperature Coefficient:±100ppm/℃ Temperature Coefficient:±100ppm/℃ Operating Temperature:-55℃~+155℃ Operating Temperature:-55℃~+155℃; LCSC Part Name: 1.8kΩ ±1% 100mW 厚膜电阻; Supplier Part: C4177; Manufacturer: UNI-ROYAL(厚声); Supplier Footprint: 0603; JLCPCB Part Class: Basic Part; Datasheet: https://item.szlcsc.com/datasheet/0603WAF1801T5E/4584.html; Supplier: LCSC; Type: Thick Film Resistor; Tolerance: ±1%; Power(Watts): 100mW; Voltage-Supply(Max): 75V; Temperature Coefficient: ±100ppm/℃; Operating Temperature: -55℃~+155℃
U30 U35 = L5973D: Function:Step-down type Output Type:Adjustable Input Voltage:4V~36V Input Voltage:4V~36V Output Voltage:1.235V~35V Output Voltage:1.235V~35V Output Current (Max):2.5A Switching Frequency:250kHz Operating Temperature:-40℃~+150℃@(TJ) Operating Temperature:-; Supplier Part: C21829; Manufacturer: ST(意法半导体); Supplier Footprint: SOIC-8-EP; JLCPCB Part Class: Extended Part; Datasheet: https://atta.szlcsc.com/upload/public/pdf/source/20150723/1457707337570.pdf; Supplier: LCSC; Function: Step-down type; Output Type: Adjustable; Input Voltage: 4V~36V; Output Voltage: 1.235V~35V; Output Current (Max): 2.5A; Switching Frequency: 250kHz; Operating Temperature: -40℃~+150℃@(TJ); Synchronous Rectification: NO; Number of Outputs: 1; Topology: Step-down; Switch tube (built-in/external): 内置
U33 U36 = PA4341.152NLT: Inductance: Tolerance:±20% Tolerance:±20% Rated Current: Saturation Current (Isat):18A DC Resistance (DCR): Type:- Ratings:AEC-Q200; LCSC Part Name: 1.5uH ±20% 18A; Supplier Part: C2453844; Manufacturer: PULSE(普思）; JLCPCB Part Class: Extended Part; Datasheet: https://atta.szlcsc.com/upload/public/pdf/source/20210417/F3519A438F6A29557BFE7F9405638BE4.pdf; Supplier: LCSC; Tolerance: ±20%; Rated Current: 15 uH; Saturation Current (Isat): 18A; DC Resistance (DCR): PA4341.153ANLT; Ratings: AEC-Q200
U34 U37 = RVT1A331M0607_C7419412: Capacitance:330uF Tolerance:±20% Tolerance:±20% Voltage Rating:10V Ripple Current:108mA@120Hz Diameter:6.3mm Height - Seated (Max):7.7mm Lifetime:2000hrs@105℃ Operating Temperature:-40℃~+105℃ Operating Temperature:-40℃~+105℃; LCSC Part Name: 330uF ±20% 10V; Supplier Part: C7419412; Manufacturer: ROQANG(容强); Manufacturer Part: RVT1A331M0607; Supplier Footprint: SMD,D6.3xL7.7mm; JLCPCB Part Class: Extended Part; Datasheet: https://atta.szlcsc.com/upload/public/pdf/source/20240430/3EB58B4CA3F3E3C85A0F856558F131F2.pdf; Supplier: LCSC; Tolerance: ±20%; Voltage Rating: 10V; Ripple Current: 108mA@120Hz; Diameter: 6.3mm; Height - Seated (Max): 7.7mm; Lifetime: 2000hrs@105℃; Operating Temperature: -40℃~+105℃

## Nets
6V: L16.1 L17.1 R94.2 R104.2 U33.2 U34.1
+3V3: C43.1 C95.2 C96.2 C97.2 C98.2 H1.1 L14.2 L20.2 L22.2 P1.3 P2.3 P4.1 R52.2 R53.2 R54.2 R105.2 U1.1(VBAT) U1.13(VDDA/VREF+) U1.19(VDD) U1.32(VDD) U1.48(VDD) U1.64(VDD) U10.19(STBY) U47.1 U48.6 U49.6 U50.6 U51.6 U52.6 U53.6
+6V_MOT: C46.1 C65.2 L16.2 L17.2 U10.13(VM2) U10.14(VM3) U10.24(VM1)
AGND: C46.2 C65.1 L18.2 L19.2 U10.3(PGND1) U10.4(PGND1) U10.9(PGND2) U10.10(PGND2)
GND: C43.2 C66.1 C67.1 C68.1 C84.1 C86.1 C87.1 C89.1 C90.1 C95.1 C96.1 C97.1 C98.1 C99.1 CN1.2 D3.1 D4.2 D5.2 L18.1 L19.1 LED7.2(K) LED8.2(K) LED15.2(K) LED16.2(K) LED17.2(K) LED18.2(K) P1.6 P2.6 P3.6 P4.2 P6.6 R55.2 R93.1 R95.1 R96.1 R103.1 SW2.2 SW3.2 SW4.2 U1.12(VSSA/VREF-) U1.18(VSS) U1.31(VSS) U1.47(VSS) U1.63(VSS) U10.18(GND) U30.3(INH) U30.7(GND) U30.9(EP) U34.2 U35.3(INH) U35.7(GND) U35.9(EP) U37.2 U47.5 U48.5 U49.5 U50.5 U51.5 U52.5 U53.5
BOOT_O: R55.1 U1.60(BOOT0)
BTN_02: C67.2 R53.1 R77.1 U1.27(PB1)
BTN_03: C68.2 R54.1 R78.1 U1.28(PB2)
ENC_OUT_A1: P1.4 U1.22(PA6)
ENC_OUT_A2: P2.4 U1.41(PA8)
ENC_OUT_B1: P1.5 U1.23(PA7)
ENC_OUT_B2: P2.5 U1.42(PA9)
GPIO0_IR_LL: U1.11(PC3) U53.1
GPIO0_IR_LM: U1.10(PC2) U52.1
GPIO0_IR_LR: U1.25(PC5) U51.1
GPIO0_IR_RL: U1.24(PC4) U50.1
GPIO0_IR_RM: U1.2(PC13) U49.1
GPIO0_IR_RR: U1.59(PB7) U48.1
GPIO1_IR_LL: R113.1 U53.2
GPIO1_IR_LM: R112.1 U52.2
GPIO1_IR_LR: R111.1 U51.2
GPIO1_IR_RL: R110.1 U50.2
GPIO1_IR_RM: R109.1 U49.2
GPIO1_IR_RR: R108.1 U48.2
I2C2_SCL: P4.3 U1.29(PB10) U48.4 U49.4 U50.4 U51.4 U52.4 U53.4
I2C2_SDA: P4.4 U1.53(PC12) U48.3 U49.3 U50.3 U51.3 U52.3 U53.3
IMU_ADR: P4.5 U1.35(PB14)
IMU_BOOT: P4.7 U1.34(PB13)
IMU_RESET: P4.8 U1.33(PB12)
LIPO+: C86.2 C89.2 D3.2 F2.1 U30.8(VCC) U35.8(VCC)
M_AIN1: U1.43(PA10) U10.21(AIN1)
M_AIN2: U1.40(PC9) U10.22(AIN2)
M_AO1: P1.1 U10.1(AO1) U10.2(AO1)
M_AO2: P1.2 U10.5(AO2) U10.6(AO2)
M_BIN1: U1.57(PB5) U10.17(BIN1)
M_BIN2: U1.39(PC8) U10.16(BIN2)
M_BO1: P2.1 U10.11(BO1) U10.12(BO1)
M_BO2: P2.2 U10.7(BO2) U10.8(BO2)
M_PWMA: U1.61(PB8) U10.23(PWMA)
M_PWMB: U1.62(PB9) U10.15(PWMB)
PA0: P5.3 R110.2 U1.14(PA0)
PA1: P5.4 R111.2 U1.15(PA1)
PA4: P5.5 R112.2 U1.20(PA4)
PA5: P5.6 R113.2 U1.21(PA5)
PB0: P5.2 R109.2 U1.26(PB0)
PC0: P5.1 R108.2 U1.8(PC0)
SPI3_CS0: P6.3 U1.36(PB15)
SPI3_CS1: P6.2 U1.58(PB6)
SPI3_MISO: P6.4 U1.52(PC11)
SPI3_MOSI: P6.5 U1.9(PC1)
SPI3_SCK: P6.1 U1.51(PC10)
ST_LED1: R46.2 U1.44(PA11)
ST_LED2: R47.2 U1.45(PA12)
ST_LED3: R107.2 U1.54(PD2)
STLINK_JTDI: P3.3 U1.50(PA15)
STLINK_NJTRST: P3.5 U1.56(PB4)
STLINK_NRST: C66.2 H1.4 R52.1 R76.1 U1.7(NRST) U47.2
STLINK_RX: H1.3 U1.17(PA3)
STLINK_SWO: P3.4 U1.55(PB3)
STLINK_TCK: P3.2 U1.49(PA14)
STLINK_TMS: P3.1 U1.46(PA13)
STLINK_TX: H1.2 U1.16(PA2)
UART_RX: U1.38(PC7) U47.4
UART_TX: U1.37(PC6) U47.3
$2N19187: CN1.1 D11.1(C) F2.2
$2N30811: C88.1 R93.2
$2N30836: D4.1 U30.1(OUT) U33.1
$2N30844: C87.2 C88.2 U30.4(COMP)
$2N33033: R94.1 R95.2 U30.5(FB)
$2N33519: C91.1 R96.2
$2N33541: D5.1 U35.1(OUT) U36.1
$2N33542: C90.2 C91.2 U35.4(COMP)
$2N33543: L14.1 L22.1 R102.2 U36.2 U37.1
$2N33549: R102.1 R103.2 U35.5(FB)
$2N34682: LED16.1(A) R105.1
$2N34710: LED15.1(A) R104.1
$2N35274: LED17.1(A) R106.1
$2N35278: D11.2(A) R106.2
$3N1929: R77.2 SW2.3
$3N2172: R78.2 SW3.3
$3N2375: R76.2 SW4.3
$3N4904: LED7.1(A) R46.1
$3N4908: LED8.1(A) R47.1
$3N7852: C84.2 L20.1 U10.20(VCC)
$3N28848: C99.2 U1.30(VCAP_1)
$3N34738: LED18.1(A) R107.1

Not connected (* = marked no-connect by the designer): P4 6*; SW2 1* 4*; SW3 1* 4*; SW4 1* 4*; U1 3(PC14-OSC32_IN)* 4(PC15-OSC32_OUT)* 5(PH0-OSC_IN)* 6(PH1-OSC_OUT)*; U30 2(SYNC)* 6(VREF)*; U35 2(SYNC)* 6(VREF)*

## Notes on the sheets
sheet 1
- IR-SENSOR3
- IR-SENSOR4
- IR-SENSOR2
- IR-SENSOR5
- IR-SENSOR1
- STM32F446RE
- IR-SENSOR6
- MotorController
  LEFT
- IMU
- MotorController
  RIGHT
- Encoder
  LEFT
- Encoder
  RIGHT
- Motor
  LEFT
- Motor
  RIGHT
sheet 2
- V_out = V_FB * ( 1 + (R1/R2))
  V_FB = 1.235V
- LIPO 7.4V (8.2V - 6V)
- Undervoltage detection:
  at 7V the LED will turn off
  change LIPO before next run
  to ensure stable power supply
sheet 3
- ST-Link Debugger
- These PIN can also
  be used for other things.
  SPI is optional.
- ST-Link Debugger
- TX Debug -> RX Controller
  RX Debug -> TX Controller
sheet 4
- GPIOS can also be used for other stuff.
